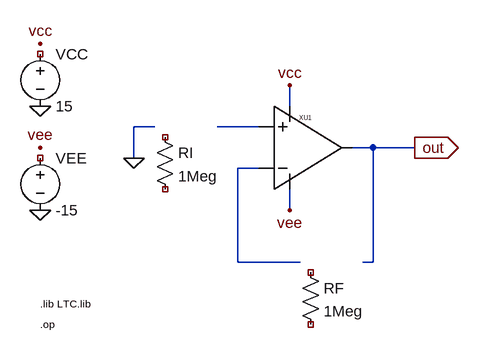
[diagram p0: schematic item2_ios.asc]
item2_ios.asc, the LTspice schematic file:
Version 4
SHEET 1 880 560
WIRE 288 192 288 240
WIRE 320 192 288 192
WIRE 480 192 416 192
WIRE 480 256 448 256
WIRE 448 256 448 400
WIRE 448 400 544 400
WIRE 640 400 656 400
WIRE 656 400 656 224
WIRE 624 224 656 224
WIRE 656 224 720 224
WIRE 528 160 528 128
WIRE 528 288 528 320
SYMBOL voltage 144 64 R0
SYMATTR InstName VCC
SYMATTR Value 15
SYMBOL voltage 144 224 R0
SYMATTR InstName VEE
SYMATTR Value -15
SYMBOL res 320 192 R0
SYMATTR InstName RI
SYMATTR Value 1Meg
SYMBOL res 544 400 R0
SYMATTR InstName RF
SYMATTR Value 1Meg
SYMBOL opamp2 480 160 R0
SYMATTR InstName XU1
SYMATTR Value OP07
FLAG 288 240 0
FLAG 144 64 vcc
FLAG 144 160 0
FLAG 144 224 vee
FLAG 144 320 0
FLAG 528 128 vcc
FLAG 528 320 vee
FLAG 720 224 out
IOPIN 720 224 Out
TEXT 144 464 Left 1 !.lib LTC.lib
TEXT 144 496 Left 1 !.op

The netlist it stands for:
* item2_ios.asc
VCC NC_01 0 15
VEE NC_02 0 -15
RI NC_03 NC_04 1Meg
RF NC_05 NC_06 1Meg
XXU1 CLAW_IDEAL_OPAMP OP07
.lib LTC.lib
.op
.backanno
.end